# Altium project CAN_ESP.PrjPcb
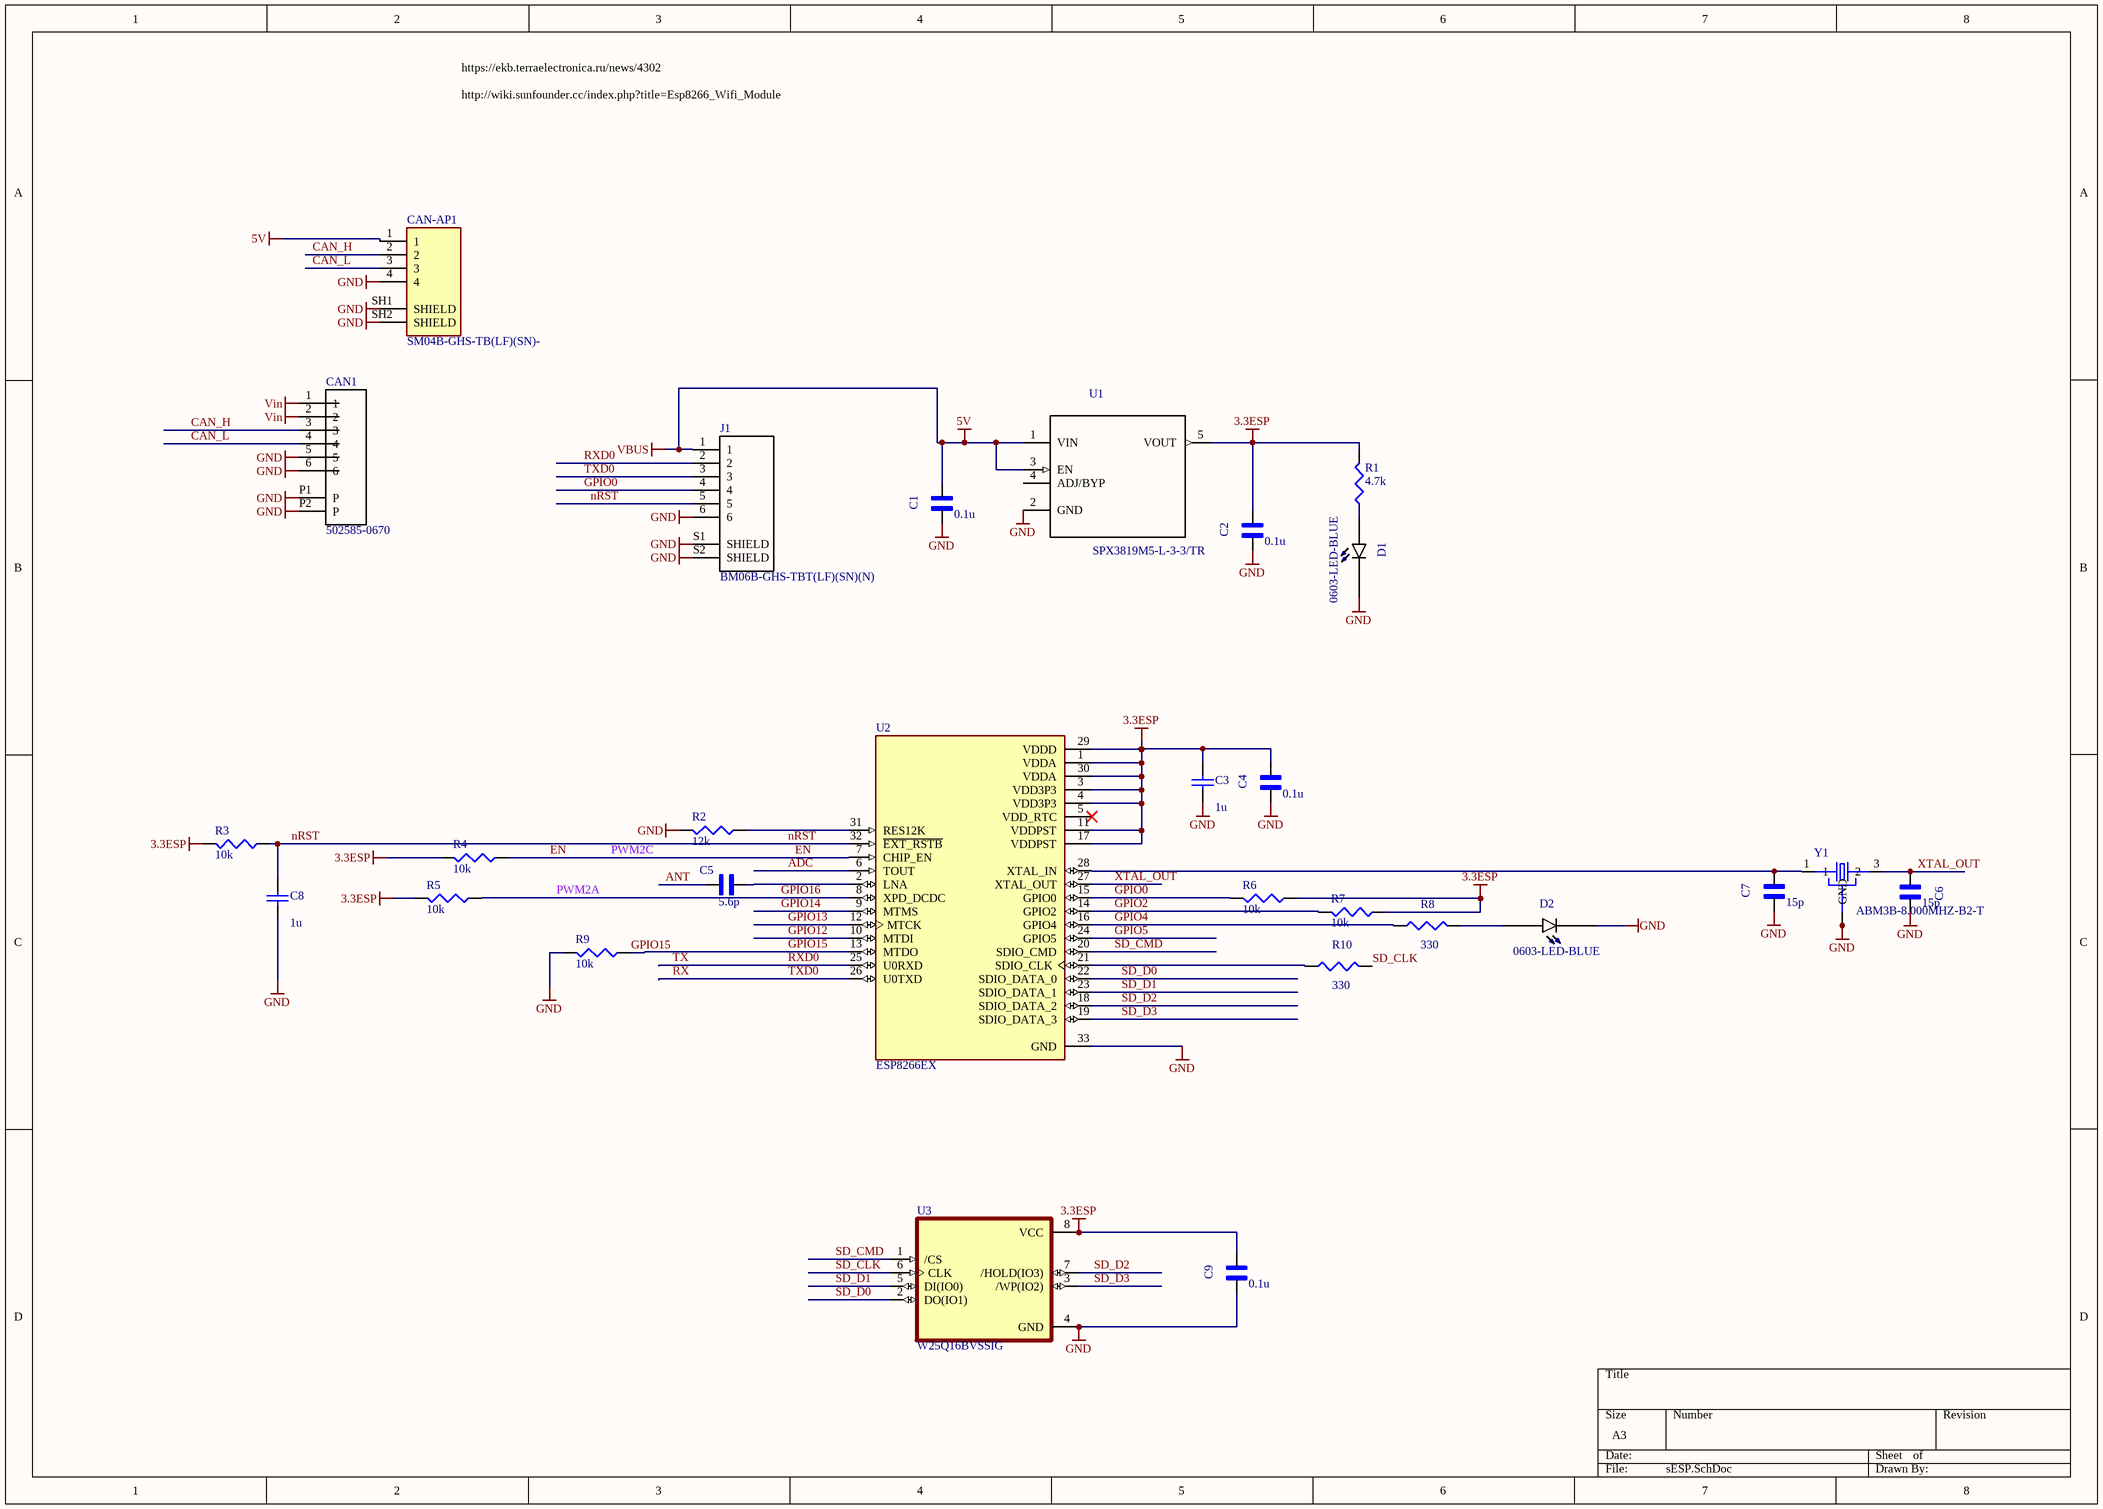
[diagram p0: sESP.SchDoc]
Quantity: 10; Version: 2
3 sheets, 66 parts. Net scope: global (net labels, ports and power ports of the same name join across sheets).
Board file: Copy of CAN_ESP.PcbDoc
Sheets:
  sESP.SchDoc
  STM32F103T8.SchDoc
  DCDC-LMR16030.SchDoc

## Sheet sESP.SchDoc
size A3; Revision: 7

### Parts
C1  value 0.1u  [*CAPC1608X90]  (hidden comment: GX035C104MAT2-500)
C2  value 0.1u  [*CAPC1608X90]  (hidden comment: GX035C104MAT2-500)
C3  value 1u  [1608[0603]]  (hidden comment: Cap Semi)
C4  value 0.1u  [*CAPC1608X90]  (hidden comment: GX035C104MAT2-500)
C5  value 5.6p  [*CAPC1608X90]  (hidden comment: GX035C104MAT2-500)
C6  value 15p  [*CAPC1608X90N]  (hidden comment: GRM1885C2A150JA01J)
C7  value 15p  [*CAPC1608X90N]  (hidden comment: GRM1885C2A150JA01J)
C8  value 1u  [1608[0603]]  (hidden comment: Cap Semi)
C9  value 0.1u  [*CAPC1608X90]  (hidden comment: GX035C104MAT2-500)
CAN1  502585-0670  [MOLEX_502585-0670]
CAN-AP1  SM04B-GHS-TB(LF)(SN)-  [JST_SM04B-GHS-TB(LF)(SN)-]
D1  0603-LED-BLUE  [*LEDM1608X80_LTE-C1906R-14(Primary)]
D2  0603-LED-BLUE  [*LEDM1608X80_LTE-C1906R-14(Primary)]
J1  BM06B-GHS-TBT(LF)(SN)(N)  [*JST_BM06B-GHS-TBT(LF)(SN)(N)_BM06B-GHS-TBT(LF)(SN)(N)(Primary)]
R1  value 4.7k  [J1-0603]  (hidden comment: Res3)
R2  value 12k  [J1-0603]  (hidden comment: RC0603FR-0710KL)
R3  value 10k  [J1-0603]  (hidden comment: Res3)
R4  value 10k  [J1-0603]  (hidden comment: Res3)
R5  value 10k  [J1-0603]  (hidden comment: Res3)
R6  value 10k  [J1-0603]  (hidden comment: Res3)
R7  value 10k  [J1-0603]  (hidden comment: Res3)
R8  value 330  [J1-0603]  (hidden comment: Res3)
R9  value 10k  [J1-0603]  (hidden comment: Res3)
R10  value 330  [J1-0603]  (hidden comment: Res3)
U1  SPX3819M5-L-3-3/TR  [*SOT95P280X145-5N]
U2  ESP8266EX  [QFN50P500X500X80-33N]
U3  W25Q16BVSSIG  [SOIC127P790X216-8N]
Y1  ABM3B-8.000MHZ-B2-T  [OSCSC500X320X110-4N]

### Nets
3.3ESP: C2.1 C3.1 C4.1 C9.1 R1.2 R3.2 R4.2 R5.2 R6.1 R7.1 U1.5(VOUT) U2.1(VDDA) U2.3(VDD3P3) U2.4(VDD3P3) U2.11(VDDPST) U2.17(VDDPST) U2.29(VDDD) U2.30(VDDA) U3.8(VCC)
5V: C1.1 CAN-AP1.1 J1.1 U1.1(VIN) U1.3(EN)  [also labelled VBUS]
GND: C1.2 C2.2 C3.2 C4.2 C6.2 C7.1 C8.2 C9.2 CAN1.5 CAN1.6 CAN1.P1(P) CAN1.P2(P) CAN-AP1.4 CAN-AP1.SH1(SHIELD) CAN-AP1.SH2(SHIELD) D1.C D2.C J1.6 J1.S1(SHIELD) J1.S2(SHIELD) R2.2 R9.2 U1.2(GND) U2.33(GND) U3.4(GND) Y1.2(GND) Y1.4(GND)
Vin: CAN1.1 CAN1.2
ADC: U2.6(TOUT)
ANT: C5.1
CAN_H: CAN1.3 CAN-AP1.2
CAN_L: CAN1.4 CAN-AP1.3
EN: R4.1 U2.7(CHIP_EN)  [also labelled PWM2C]
GPIO0: J1.4 R6.2 U2.15(GPIO0)
GPIO2: R7.2 U2.14(GPIO2)
GPIO4: R8.1 U2.16(GPIO4)
GPIO5: U2.24(GPIO5)
GPIO12: U2.10(MTDI)
GPIO13: U2.12(MTCK)
GPIO14: U2.9(MTMS)
GPIO15: R9.1 U2.13(MTDO)
GPIO16: R5.1 U2.8(XPD_DCDC)  [also labelled PWM2A]
nRST: C8.1 J1.5 R3.1 U2.32(~{EXT_RSTB})
RX: J1.3 U2.26(U0TXD)  [also labelled TXD0]
RXD0: J1.2 U2.25(U0RXD)  [also labelled TX]
SD_CLK: R10.2 U3.6(CLK)
SD_CMD: U2.20(SDIO_CMD) U3.1(/CS)
SD_D0: U2.22(SDIO_DATA_0) U3.2(DO(IO1))
SD_D1: U2.23(SDIO_DATA_1) U3.5(DI(IO0))
SD_D2: U2.18(SDIO_DATA_2) U3.7(/HOLD(IO3))
SD_D3: U2.19(SDIO_DATA_3) U3.3(/WP(IO2))
XTAL_OUT: C6.1 U2.27(XTAL_OUT) Y1.3(2)
NetC5_2: C5.2 U2.2(LNA)
NetC7_2: C7.2 U2.28(XTAL_IN) Y1.1
NetD1_A: D1.A R1.1
NetD2_A: D2.A R8.2
NetR2_1: R2.1 U2.31(RES12K)
NetR10_1: R10.1 U2.21(SDIO_CLK)

Not connected (* = marked no-connect by the designer): U1 4(ADJ/BYP); U2 5(VDD_RTC)*

### Notes on the sheet
- https://ekb.terraelectronica.ru/news/4302
- http://wiki.sunfounder.cc/index.php?title=Esp8266_Wifi_Module

### Library data of the parts
C1 C2 = GX035C104MAT2-500: Cap Thin Film 0.1uf 50v 0603; MF: AVX; Pacage Metric: 1608; Type: SMD; Package: 0603 AVX; MP: GX035C104MAT2-500; SnapEDA_Link: https://www.snapeda.com/parts/GX035C104MAT2-500/AVX/view-part/?ref=snap
C3 C8 = Cap Semi: Capacitor (Semiconductor SIM Model); Published: 8-Jun-2000; LatestRevisionDate: 29-May-2009; LatestRevisionNote: IPC-7351 Footprint Added.; PackageReference: C1206; Publisher: Altium Limited; PackageDescription: Chip Capacitor
C4 C5 C9 = GX035C104MAT2-500: Cap Thin Film 0.1uf 50v 0603; MF: AVX; MP: GX035C104MAT2-500 or CL10B104JB8NNNC; Pacage Metric: 1608; Type: SMD; Package: 0603 AVX; SnapEDA_Link: https://www.snapeda.com/parts/GX035C104MAT2-500/AVX/view-part/?ref=snap
CAN1 = 502585-0670: 1.50mm Pitch, CLIK-Mate PCB Receptacle, Single Row, Surface Mount, Right-Angle, Tin Plating, Positive Lock, 6 Circuits, Natural; MF: Molex; System: Connector; MP: 502585-0670; Package: None; SnapEDA_Link: https://www.snapeda.com/parts/502494-0670/Molex/view-part/?ref=snap; Value: *; Type: SMD
CAN-AP1 = SM04B-GHS-TB(LF)(SN)-: Connector Header Surface Mount, Right Angle 4 position 0.049 _1.25mm_; MF: JST Sales; MP: SM04B-GHS-TB(LF)(SN); Package: None; Value: *; SnapEDA_Link: https://www.snapeda.com/parts/SM04B-GHS-TB%28LF%29%28SN%29-/JST%20Sales%20America%20Inc./view-part/2759740/?ref=snap; HelpURL: http://www.farnell.com/datasheets/2082975.pdf; System: Connector; ChipDip_Link: https://www.chipdip.ru/product/sm04b-ghs-tb-lf-sn-gh-1.25mm-header-side-ent
D1 D2 = LTE-C1906R-14: LED IrLED Chip LED 2-Pin SMD T/R; Package: 0603 Lite-On; MP: 0603-LED-BLUE; SnapEDA_Link: https://www.snapeda.com/parts/LTE-C1906R-14/Lite-On%20Inc./view-part/?ref=snap; Value: *; Type: SMD
J1 = BM06B-GHS-TBT(LF)(SN)(N): Conn Header Gh Top 6pos 1.25mm; MP: BM06B-GHS-TBT_LF__SN__N_; MF: JST Sales; Package: None; Availability: Unavailable; SnapEDA_Link: https://www.snapeda.com/parts/BM06B-GHS-TBT%28LF%29%28SN%29%28N%29/JST%20Sales%20America%20Inc./view-part/?ref=snap; Price: None; Value: *
R1 = Res3: Resistor; Pacage Metric: 1608; MP: 4.7K 1% 0603; ChipDip_Link: https://www.chipdip.ru/product0/9000079736; HelpURL: https://www.chipdip.ru/product0/9000079736; Package: R0603; Type: SMD
R2 = RC0603FR-0710KL: 10 kOhms 1 0.1 W 1 10 W Chip Resistor 0603 1608 Metric Thick Film; Pacage Metric: 1608; MF: Yageo or NXP; MP: 10K 1% 0603; ChipDip_Link: https://www.chipdip.ru/product0/9000079736; HelpURL: https://www.chipdip.ru/product0/9000079736; Package: R0603; Type: SMD; SnapEDA_Link: https://www.snapeda.com/parts/RC0603FR-0710KL/Yageo/view-part/?ref=dk&t=RC0603FR-0710KL&con_ref=None
R3-R7 R9 = Res3: Resistor; Pacage Metric: 1608; MP: 10K 1% 0603; ChipDip_Link: https://www.chipdip.ru/product0/9000079736; HelpURL: https://www.chipdip.ru/product0/9000079736; Package: R0603; Type: SMD
R8 R10 = Res3: Resistor; Pacage Metric: 1608; MP: RC0603FR-07330RL; ChipDip_Link: https://www.chipdip.ru/product0/9000079628; HelpURL: https://www.chipdip.ru/product0/9000079628; Package: R0603; Type: SMD
U1 = SPX3819M5-L: Low Dropout Voltage Regulator, Adjustable 0.5A, В±1%, 2.5 to 16 Vin, 5-Pin SOT-23; MF: MaxLinear, Inc.; Value: 3V3; MP: SPX3819M5-L-3-3/TR; Package: SOT-23-5 Exar; SnapEDA_Link: https://www.snapeda.com/parts/SPX3819M5-L/MaxLinear%2C%20Inc./view-part/?ref=snap; Type: SMD; ChipDip_Link: https://www.chipdip.ru/product1/8003455237; HelpURL: http://www.farnell.com/datasheets/2614478.pdf
U2 = ESP8266EX: IC RF TxRx + MCU WiFi 802.11b/g/n 2.4GHz 32-VFQFN Exposed Pad; MF: Espressif Systems; SnapEDA_Link: https://www.snapeda.com/parts/ESP8266EX/Espressif%20Systems/view-part/555861/?ref=snap; Value: *; Purchase-URL: https://pricing.snapeda.com/search/part/ESP8266EX/?ref=eda; Price: None; Availability: Warning; MP: ESP8266EX; Package: VFQFN-32 Espressif Systems; Check_prices: https://www.snapeda.com/parts/ESP8266EX/Espressif%20Systems/view-part/555861/?ref=eda
U3 = W25Q16BVSSIG: Flash, pin, soic, flash, Memory, Semiconductors and Actives, serial, ic; MF: {'manufacturer': u'Winbond'}; MP: W25Q16BVSSIG; Availability: Unavailable; Value: *; Price: None; Package: None
Y1 = ABM3B-8.000MHZ-B2-T: Crystal 8MHz В±20ppm (Tol) В±50ppm (Stability) 18pF FUND 200Ohm 4-Pin CSMD T/R; MF: {'manufacturer': u'Abracon'}; Value: *; Price: None; Package: None; Availability: Unavailable; MP: ABM3B-8.000MHZ-B2-T
C6 C7 = GRM1885C2A150JA01J: SnapEDA_Link: https://www.snapeda.com/parts/GRM1885C2A150JA01J/Murata/view-part/1812122/?ref=snap; ChipDip_Link: https://www.chipdip.ru/product/grm1885c2a150j; HelpURL: https://static.chipdip.ru/lib/428/DOC005428493.pdf

## Sheet STM32F103T8.SchDoc
size A3; Revision: 10
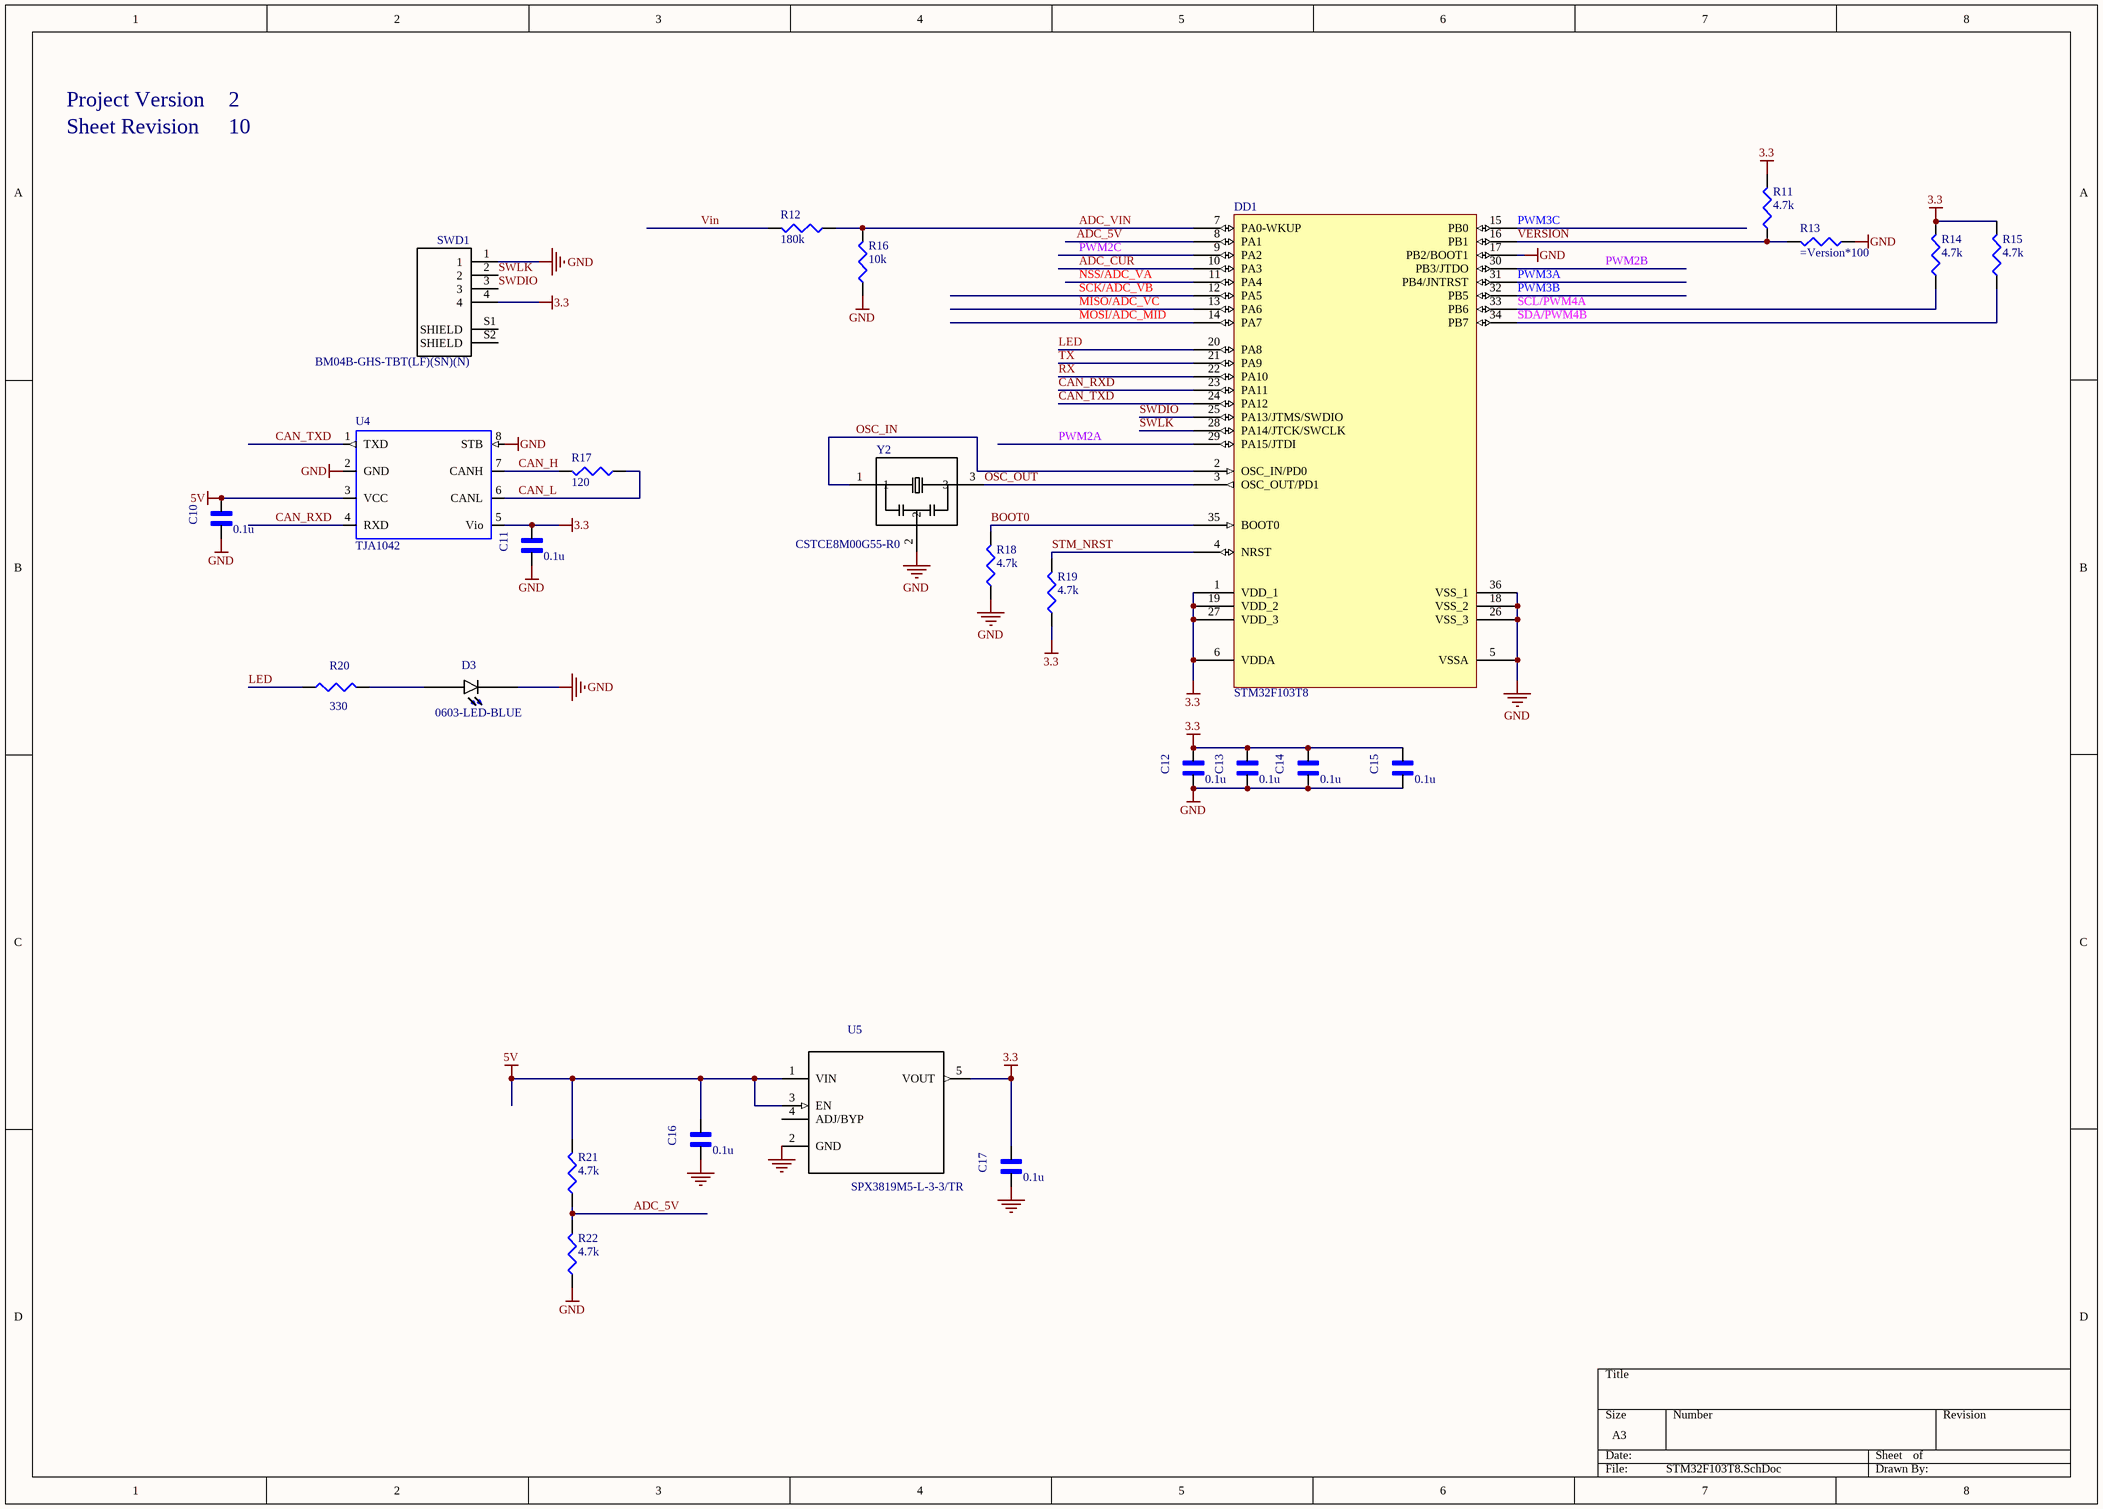
[diagram p1: STM32F103T8.SchDoc]

### Parts
C10  value 0.1u  [*CAPC1608X90]  (hidden comment: GX035C104MAT2-500)
C11  value 0.1u  [*CAPC1608X90]  (hidden comment: GX035C104MAT2-500)
C12  value 0.1u  [*CAPC1608X90]  (hidden comment: GX035C104MAT2-500)
C13  value 0.1u  [*CAPC1608X90]  (hidden comment: GX035C104MAT2-500)
C14  value 0.1u  [*CAPC1608X90]  (hidden comment: GX035C104MAT2-500)
C15  value 0.1u  [*CAPC1608X90]  (hidden comment: GX035C104MAT2-500)
C16  value 0.1u  [*CAPC1608X90]  (hidden comment: GX035C104MAT2-500)
C17  value 0.1u  [*CAPC1608X90]  (hidden comment: GX035C104MAT2-500)
D3  0603-LED-BLUE  [*LEDM1608X80_LTE-C1906R-14(Primary)]
DD1  STM32F103T8  [*QFN50P600X600X100-37N]
R11  value 4.7k  [J1-0603]  (hidden comment: Res3)
R12  value 180k  [J1-0603]  (hidden comment: Res3)
R13  Res3  [J1-0603]  (value not drawn)
R14  value 4.7k  [J1-0603]  (hidden comment: Res3)
R15  value 4.7k  [J1-0603]  (hidden comment: Res3)
R16  value 10k  [J1-0603]  (hidden comment: Res3)
R17  value 120  [J1-0603]  (hidden comment: Res3)
R18  value 4.7k  [J1-0603]  (hidden comment: Res3)
R19  value 4.7k  [J1-0603]  (hidden comment: Res3)
R20  value 330  [J1-0603]  (hidden comment: Res3)
R21  value 4.7k  [J1-0603]  (hidden comment: Res3)
R22  value 4.7k  [J1-0603]  (hidden comment: Res3)
SWD1  BM04B-GHS-TBT(LF)(SN)(N)  [JST_BM04B-GHS-holes]
U4  TJA1042  [SOT782-1]
U5  SPX3819M5-L-3-3/TR  [*SOT95P280X145-5N]
Y2  CSTCE8M00G55-R0  [*OSC_CSTCE8M00G55-R0]

### Nets
3.3: C11.1 C12.1 C13.1 C14.1 C15.1 C17.1 DD1.1(VDD_1) DD1.6(VDDA) DD1.19(VDD_2) DD1.27(VDD_3) R11.2 R14.2 R15.2 R19.1 SWD1.4 U4.5(Vio) U5.5(VOUT)
5V: C10.1 C16.1 R21.2 U4.3(VCC) U5.1(VIN) U5.3(EN)
GND: C10.2 C11.2 C12.2 C13.2 C14.2 C15.2 C16.2 C17.2 D3.C DD1.5(VSSA) DD1.17(PB2/BOOT1) DD1.18(VSS_2) DD1.26(VSS_3) DD1.36(VSS_1) R13.1 R16.1 R18.1 R22.1 SWD1.1 U4.2(GND) U4.8(STB) U5.2(GND) Y2.2
Vin: R12.2
ADC_5V: DD1.8(PA1) R21.1 R22.2
ADC_CUR: DD1.10(PA3)
ADC_VIN: DD1.7(PA0-WKUP) R12.1 R16.2
BOOT0: DD1.35(BOOT0) R18.2
CAN_H: R17.2 U4.7(CANH)
CAN_L: R17.1 U4.6(CANL)
CAN_RXD: DD1.23(PA11) U4.4(RXD)
CAN_TXD: DD1.24(PA12) U4.1(TXD)
LED: DD1.20(PA8) R20.1
MISO/ADC_VC: DD1.13(PA6)
MOSI/ADC_MID: DD1.14(PA7)
NSS/ADC_VA: DD1.11(PA4)
OSC_IN: DD1.2(OSC_IN/PD0) Y2.1
OSC_OUT: DD1.3(OSC_OUT/PD1) Y2.3
PWM2A: DD1.29(PA15/JTDI)  [project net GPIO16]
PWM2B: DD1.30(PB3/JTDO)
PWM2C: DD1.9(PA2)  [project net EN]
PWM3A: DD1.31(PB4/JNTRST)
PWM3B: DD1.32(PB5)
PWM3C: DD1.15(PB0)
RX: DD1.22(PA10)
SCK/ADC_VB: DD1.12(PA5)
SCL/PWM4A: DD1.33(PB6) R14.1
SDA/PWM4B: DD1.34(PB7) R15.1
STM_NRST: DD1.4(NRST) R19.2
SWDIO: DD1.25(PA13/JTMS/SWDIO) SWD1.3
SWLK: DD1.28(PA14/JTCK/SWCLK) SWD1.2
TX: DD1.21(PA9)  [project net RXD0]
VERSION: DD1.16(PB1) R11.1 R13.2
NetD3_A: D3.A R20.2

Not connected (* = marked no-connect by the designer): SWD1 S1(SHIELD) S2(SHIELD); U5 4(ADJ/BYP)

### Notes on the sheet
- Project Version
- Sheet Revision

### Library data of the parts
C10-C17 = GX035C104MAT2-500: as C1 on sheet sESP; Package: 0603 AVX; MP: GX035C104MAT2-500; SnapEDA_Link: https://www.snapeda.com/parts/GX035C104MAT2-500/AVX/view-part/?ref=snap
D3 = LTE-C1906R-14: LED IrLED Chip LED 2-Pin SMD T/R; Package: 0603 Lite-On; MP: 0603-LED-BLUE; SnapEDA_Link: https://www.snapeda.com/parts/LTE-C1906R-14/Lite-On%20Inc./view-part/?ref=snap; Value: *; Type: SMD
DD1 = STM32F103T8: STM32F103T8U6, Микроконтроллер 32BIT ARM 64K FLASH [VFQFPN-36]; MF: STM; ChipDip_Link: https://www.chipdip.ru/product/stm32f103t8u6-2; HelpURL: http://www.st.com/stonline/products/literature/ds/13587.pdf; MP: STM32F103T8U6; Package: VFQFPN-36; SnapEDA_Link: https://www.snapeda.com/parts/STM32F103T8U6TR/STMicroelectronics/view-part/?ref=search&t=STM32F103T8U6; Type: SMD
R11 R13-R16 R18 R19 R21 R22 = Res3: as R1 on sheet sESP; ChipDip_Link: https://www.chipdip.ru/product0/9000079736; HelpURL: https://www.chipdip.ru/product0/9000079736; Package: R0603; Type: SMD
  R13: Value: =Version*100
R12 = Res3: Resistor; Pacage Metric: 1608; MP: 180K 1% 0603; Package: R0603; Type: SMD
R17 = Res3: 120 Ohms 1 0.1 W 1 10 W Chip Resistor 0603 1608 Metric Thick Film; Pacage Metric: 1608; MP: RC0603FR-07120RL; ChipDip_Link: https://www.chipdip.ru/product0/9000079618; HelpURL: https://www.chipdip.ru/product0/9000079618; Package: R0603; Type: SMD
R20 = Res3: as R8 on sheet sESP; ChipDip_Link: https://www.chipdip.ru/product0/9000079628; HelpURL: https://www.chipdip.ru/product0/9000079628; Package: R0603; Type: SMD
SWD1 = BM04B-GHS-TBT(LF)(SN)(N): Conn Shrouded Header HDR 4 POS 1.25mm Solder ST SMD Reel; MF: JST Sales; MP: SM04B-GHS-TB(LF)(SN); Instructions: Do not install; System: Connector; SnapEDA_Link: https://www.snapeda.com/parts/BM04B-GHS-TBT%28LF%29%28SN%29%28N%29/JST%20Sales%20America%20Inc./view-part/?ref=snap; Package: None; Value: *; Type: SMD
U4 = TJA1042: 1/1 Transceiver Half CANbus 8-SO; MF: NXP USA; SnapEDA_Link: https://www.snapeda.com/parts/TJA1042/NXP%20USA%20Inc./view-part/900919/?ref=snap; Value: *; MP: TJA1042; Package: VDFN-8 NXP USA; ChipDip_Link: https://www.chipdip.ru/product1/8002840332; HelpURL: https://static.chipdip.ru/lib/583/DOC001583059.pdf; Type: SMD
U5 = SPX3819M5-L: as U1 on sheet sESP; MP: SPX3819M5-L-3-3/TR; Package: SOT-23-5 Exar; SnapEDA_Link: https://www.snapeda.com/parts/SPX3819M5-L/MaxLinear%2C%20Inc./view-part/?ref=snap; Type: SMD; ChipDip_Link: https://www.chipdip.ru/product1/8003455237; HelpURL: http://www.farnell.com/datasheets/2614478.pdf
Y2 = CSTCE8M00G55-R0: Ceramic Resonator 8MHz ??0.5% _Tol_ ??0.2% _Stability_ 33pF 40Ohm 3-Pin CSMD T/R; MF: Murata; MP: CSTCE8M00G55-R0; Package: SMD-3 Murata; SnapEDA_Link: https://www.snapeda.com/parts/CSTCE8M00G55-R0/Murata%20Electronics%20North%20America/view-part/?ref=snap; Value: *; ChipDip_Link: https://www.chipdip.ru/product1/8001783721; HelpURL: https://www.murata.com/en-eu/api/pdfdownloadapi?cate=&partno=CSTCE8M00G55-R0; Type: SMD

## Sheet DCDC-LMR16030.SchDoc
size A3; Revision: 8
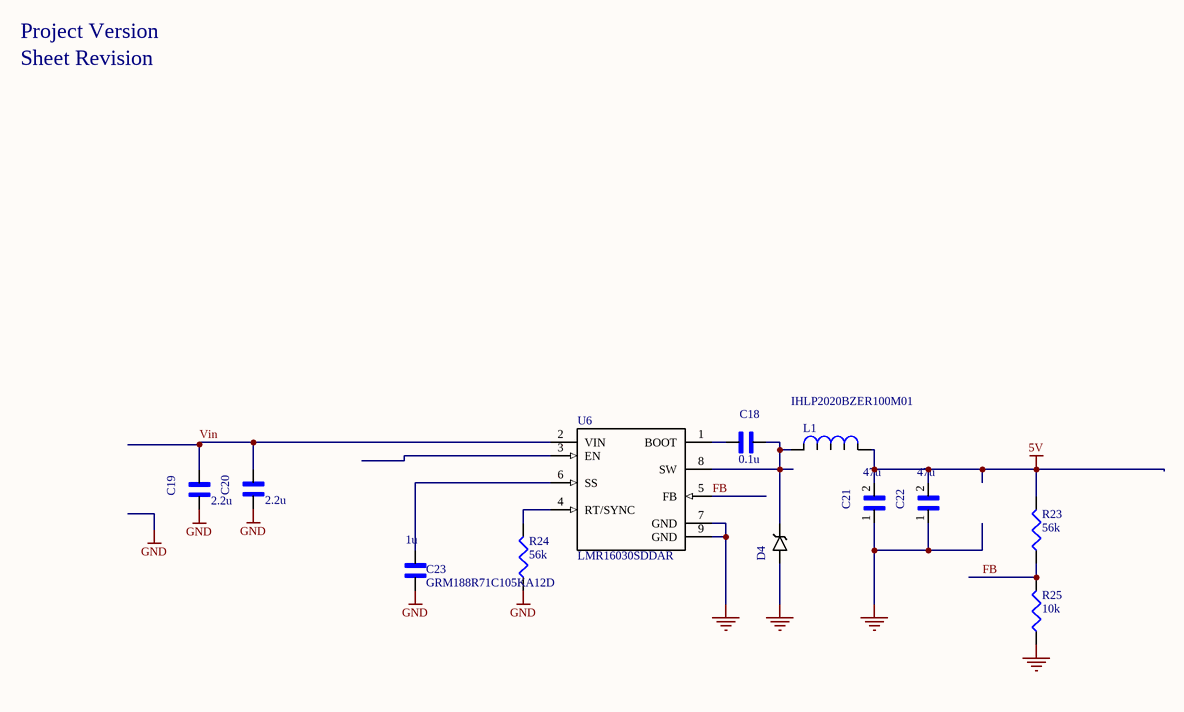
[diagram p2: DCDC-LMR16030.SchDoc]

### Parts
C18  value 0.1u  [*CAPC1608X90]  (hidden comment: GX035C104MAT2-500)
C19  value 2.2u  [*CAP3216X125N]  (hidden comment: GRM31CR71H225KA88L)
C20  value 2.2u  [*CAP3216X125N]  (hidden comment: GRM31CR71H225KA88L)
C21  value 47u  [*CAPC3216X125N]  (hidden comment: GRM31CR61A476KE15L)
C22  value 47u  [*CAPC3216X125N]  (hidden comment: GRM31CR61A476KE15L)
C23  GRM188R71C105KA12D  value 1u  [CAPC1608X90N]
D4  SK56  [*SMB_P6SMB62AT3G(Primary)]  (value not drawn)
L1  IHLP2020BZER100M01  [IHLP]
R23  value 56k  [J1-0603]  (hidden comment: Res3)
R24  value 56k  [J1-0603]  (hidden comment: Res3)
R25  value 10k  [J1-0603]  (hidden comment: RC0603FR-0710KL)
U6  LMR16030SDDAR  [*SOIC127P600X170-9N - duplicate]

### Nets
5V: C21.2 C22.2 L1.1 R23.2
GND: C19.2 C20.2 C21.1 C22.1 C23.1 D4.A R24.1 R25.1 U6.7(GND) U6.9(GND)
Vin: C19.1 C20.1 U6.2(VIN)
FB: R23.1 R25.2 U6.5(FB)
NetC18_1: C18.1 D4.C L1.2 U6.8(SW)
NetC18_2: C18.2 U6.1(BOOT)
NetC23_2: C23.2 U6.6(SS)
NetR24_2: R24.2 U6.4(RT/SYNC)

Not connected (* = marked no-connect by the designer): U6 3(EN)

### Notes on the sheet
- Project Version
- Sheet Revision

### Library data of the parts
C18 = GX035C104MAT2-500: as C4 on sheet sESP; Package: 0603 AVX; SnapEDA_Link: https://www.snapeda.com/parts/GX035C104MAT2-500/AVX/view-part/?ref=snap
C19 C20 = GRM31CR71H225KA88L: 1206 2.2 uF 50 V В±10% Tolerance X7R SMT Multilayer Ceramic Capacitor; MF: Murata Electronics; Type: SMD; Package: 1206 Murata; SnapEDA_Link: https://www.snapeda.com/parts/GRM31CR71H225KA88L/Murata%20Electronics%20North%20America/view-part/?ref=snap; MP: GRM31CR71H225KA88L
C21 C22 = GRM31CR61A476KE15L: Multilayer Ceramic Capacitor, GRM Series, 47 - F, - 10%, X5R, 10 V, 1206 [3216 Metric]; MF: Murata Electronics; Type: SMD; Package: 1206 Murata Electronics; MP: GRM31CR61A476KE15L; SnapEDA_Link: https://www.snapeda.com/parts/GRM31CR61A476KE15L/Murata%20Electronics%20North%20America/view-part/?ref=snap
C23 = GRM188R71C105KA12D: SMD Capacitor X7R(EIA) with Capacitance: 1.0uF Tol. 10%. Rated Voltage: 16Vdc; MF: Murata Electronics; Pacage Metric: 1608; MP: GRM188R71C105KA12D; SnapEDA_Link: https://www.snapeda.com/parts/GRM188R71C105KA12D/Murata%20Electronics%20North%20America/view-part/228340/?ref=snap; Package: 0603; ChipDip_Link: https://www.chipdip.ru/product/grm188r71c105ka12d; HelpURL: https://static.chipdip.ru/lib/428/DOC005428493.pdf; Type: SMD
D4 = SK56: Диод Шоттки 5А 60В [SMB / DO-214AA]; MF: Littelfuse Inc.; Type: SMD; MP: SK56; Package: DO-214 Littelfuse; SnapEDA_Link: https://www.snapeda.com/parts/P6SMB62AT3G/Littelfuse%20Inc./view-part/?ref=snap; Value: *; ChipDip_Link: https://www.chipdip.ru/product/sk56
L1 = IHLP2020BZER100M01: 10ÂµH Shielded Molded Inductor 2.3A 199mOhm Max Nonstandard; MF: Vishay Dale; Type: SMD; SnapEDA_Link: https://www.snapeda.com/parts/IHLP2020BZER100M01/Vishay%20Dale/view-part/44808/?ref=snap; MP: IHLP2020BZER100M01; Value: *; Package: Nonstandard Vishay; HelpURL: http://www.vishay.com/docs/34253/ihlp-2020bz-01.pdf; ChipDip_Link: https://www.chipdip.ru/product/ihlp2020bzer100m11-inductor-ihlp-smd-2020-10
R23 R24 = Res3: Resistor; Pacage Metric: 1608; MP: RC0603FR-0756KL; ChipDip_Link: https://www.chipdip.ru/product0/9000079754; HelpURL: https://www.chipdip.ru/product0/9000079754; Package: R0603; Type: SMD
R25 = RC0603FR-0710KL: as R2 on sheet sESP; ChipDip_Link: https://www.chipdip.ru/product0/9000079736; HelpURL: https://www.chipdip.ru/product0/9000079736; Package: R0603; Type: SMD; SnapEDA_Link: https://www.snapeda.com/parts/RC0603FR-0710KL/Yageo/view-part/?ref=dk&t=RC0603FR-0710KL&con_ref=None
U6 = LMR16030SDDAR: LMR16030SDDAR, Conv DC-DC 4.3V to 60V Step Down Single-Out 1V to 50V 3A Automotive 8-Pin HSOP EP T/R; MF: Texas Instruments; SnapEDA_Link: https://www.snapeda.com/parts/TPS54560DDA/Texas%20Instruments/view-part/?ref=snap; MP: LMR16030SDDAR; Package: PowerSOIC-8 Texas Instruments; Value: *; Type: SMD; ChipDip_Link: https://www.chipdip.ru/product1/8003448566; HelpURL: https://www.ti.com/lit/ds/symlink/lmr16030.pdf

## Nets that join several sheets
5V: sESP (5 pins), STM32F103T8 (6 pins), DCDC-LMR16030 (C21.2 C22.2 L1.1 R23.2)
GND: sESP (27 pins), STM32F103T8 (23 pins), DCDC-LMR16030 (10 pins)
Vin: sESP (CAN1.1 CAN1.2), STM32F103T8 (R12.2), DCDC-LMR16030 (C19.1 C20.1 U6.2)
CAN_H: sESP (CAN1.3 CAN-AP1.2), STM32F103T8 (R17.2 U4.7)
CAN_L: sESP (CAN1.4 CAN-AP1.3), STM32F103T8 (R17.1 U4.6)
EN: sESP (R4.1 U2.7), STM32F103T8 (DD1.9)
GPIO16: sESP (R5.1 U2.8), STM32F103T8 (DD1.29)
RX: sESP (J1.3 U2.26), STM32F103T8 (DD1.22)
RXD0: sESP (J1.2 U2.25), STM32F103T8 (DD1.21)